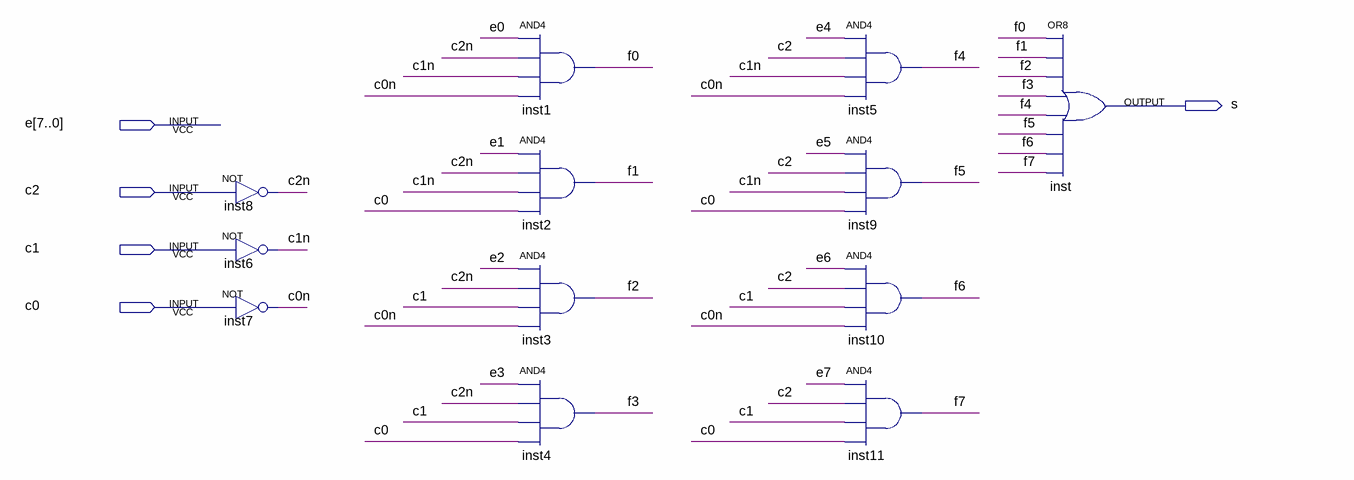
[diagram p0: schematic sheet]
// Quartus schematic mux_8x1.bdf as structural Verilog: 12 symbols, 5 pins
module mux_8x1 (
  input  [7:0] e,
  input  c2,
  input  c1,
  input  c0,
  output s
);

  wire c0n, c1n, c2n, f0, f1, f2, f3, f4, f5, f6, f7;

  not inst8 (c2n, c2);
  not inst6 (c1n, c1);
  not inst7 (c0n, c0);
  and inst1 (f0, e[0], c2n, c1n, c0n);
  and inst2 (f1, e[1], c2n, c1n, c0);
  and inst3 (f2, e[2], c2n, c1, c0n);
  and inst4 (f3, e[3], c2n, c1, c0);
  and inst5 (f4, e[4], c2, c1n, c0n);
  and inst9 (f5, e[5], c2, c1n, c0);
  and inst10 (f6, e[6], c2, c1, c0n);
  and inst11 (f7, e[7], c2, c1, c0);
  or inst (s, f0, f1, f2, f3, f4, f5, f6, f7);
endmodule
